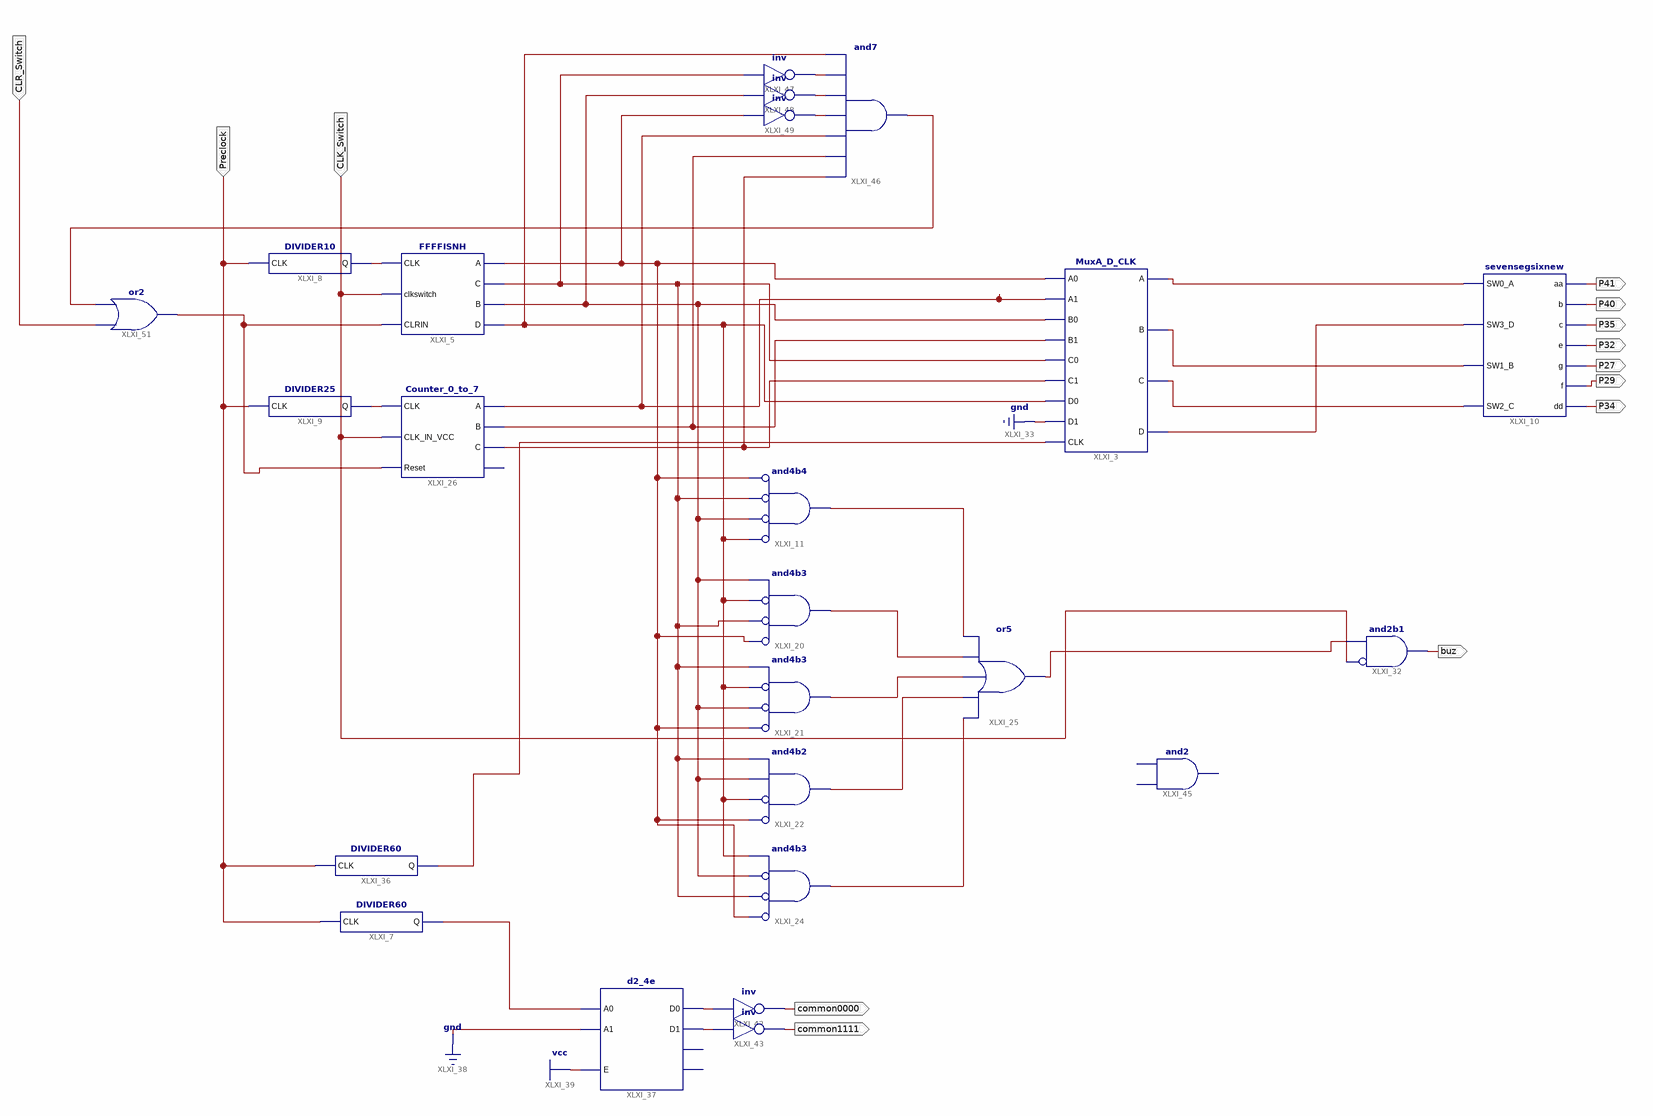
[diagram p0: schematic sheet 1]
// Xilinx ISE schematic Lab6new.sch (spartan6) as structural Verilog: 24 symbols, 13 ports
module Lab6new (
  input  CLR_Switch,
  input  CLK_Switch,
  input  Preclock,
  output P41,
  output P40,
  output P35,
  output P32,
  output P27,
  output P29,
  output P34,
  output buz,
  output common0000,
  output common1111
);

  wire XLXN_1, XLXN_2, XLXN_3, XLXN_4, XLXN_57, XLXN_58, XLXN_97, XLXN_98, XLXN_99, XLXN_100, XLXN_101,
       XLXN_126, XLXN_131, XLXN_137, XLXN_138, XLXN_141, XLXN_153, XLXN_154, XLXN_155, XLXN_156, XLXN_157,
       XLXN_158, XLXN_159, XLXN_160, XLXN_161, XLXN_162, XLXN_164, XLXN_165;

  MuxA_D_CLK XLXI_3 (
    .A0(XLXN_156), .A1(XLXN_160), .B0(XLXN_157), .B1(XLXN_161), .C0(XLXN_158), .C1(XLXN_162), .D0(XLXN_159),
    .D1(1'b0), .CLK(XLXN_126), .A(XLXN_1), .B(XLXN_2), .C(XLXN_3), .D(XLXN_4));
  FFFFISNH XLXI_5 (
    .CLK(XLXN_57), .clkswitch(CLK_Switch), .CLRIN(XLXN_164), .A(XLXN_156), .C(XLXN_158), .B(XLXN_157),
    .D(XLXN_159));
  DIVIDER60 XLXI_7 (.CLK(Preclock), .Q(XLXN_131));
  DIVIDER10 XLXI_8 (.CLK(Preclock), .Q(XLXN_57));
  DIVIDER25 XLXI_9 (.CLK(Preclock), .Q(XLXN_58));
  sevensegsixnew XLXI_10 (
    .SW0_A(XLXN_1), .SW3_D(XLXN_4), .SW1_B(XLXN_2), .SW2_C(XLXN_3), .aa(P41), .b(P40), .c(P35), .e(P32),
    .g(P27), .f(P29), .dd(P34));
  and XLXI_11 (XLXN_97, ~XLXN_159, ~XLXN_157, ~XLXN_158, ~XLXN_156);  // and4b4
  and XLXI_20 (XLXN_98, ~XLXN_156, ~XLXN_158, ~XLXN_159, XLXN_157);  // and4b3
  and XLXI_21 (XLXN_99, ~XLXN_156, ~XLXN_157, ~XLXN_159, XLXN_158);  // and4b3
  and XLXI_22 (XLXN_100, ~XLXN_156, ~XLXN_159, XLXN_157, XLXN_158);  // and4b2
  and XLXI_24 (XLXN_101, ~XLXN_156, ~XLXN_158, ~XLXN_157, XLXN_159);  // and4b3
  or XLXI_25 (XLXN_141, XLXN_101, XLXN_100, XLXN_99, XLXN_98, XLXN_97);
  Counter_0_to_7 XLXI_26 (
    .CLK(XLXN_58), .CLK_IN_VCC(CLK_Switch), .Reset(XLXN_164), .A(XLXN_160), .B(XLXN_161), .C(XLXN_162));  // open: TC
  and XLXI_32 (buz, ~CLK_Switch, XLXN_141);  // and2b1
  DIVIDER60 XLXI_36 (.CLK(Preclock), .Q(XLXN_126));
  d2_4e XLXI_37 (.A0(XLXN_131), .A1(1'b0), .E(1'b1), .D0(XLXN_137), .D1(XLXN_138));  // open: D2, D3
  not XLXI_42 (common0000, XLXN_137);
  not XLXI_43 (common1111, XLXN_138);
  // and2 XLXI_45 is placed but not wired
  and XLXI_46 (XLXN_165, XLXN_162, XLXN_161, XLXN_160, XLXN_155, XLXN_154, XLXN_153, XLXN_159);
  not XLXI_47 (XLXN_153, XLXN_158);
  not XLXI_48 (XLXN_154, XLXN_157);
  not XLXI_49 (XLXN_155, XLXN_156);
  or XLXI_51 (XLXN_164, CLR_Switch, XLXN_165);
endmodule
